# EAGLE schematic arduino_uno_to_attiny_x4 (EAGLE 9.2.2)
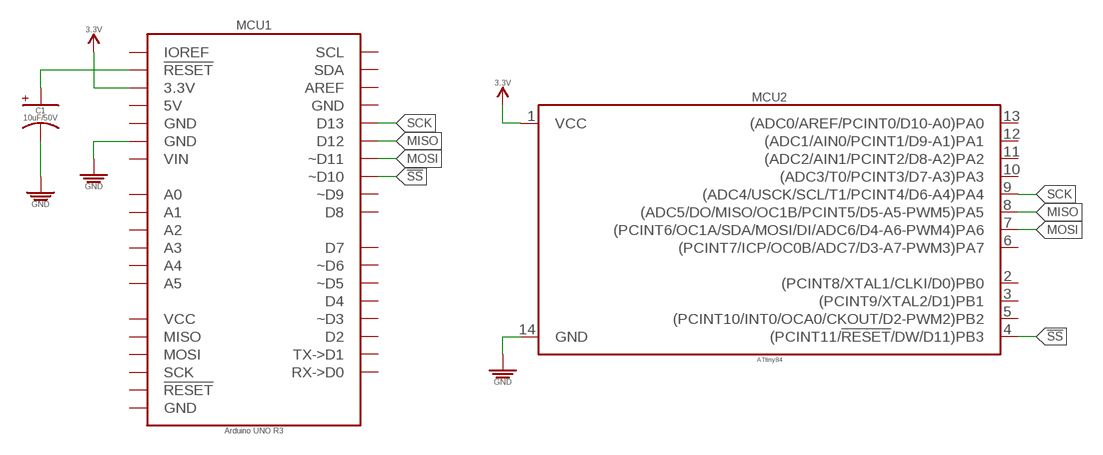
[diagram p0: schematic, sheet 1]

## Parts
C1  10uF/50V  10UF-POLARIZED_PTH_50V-20%  [_AE_PTH-DIA5-LS2-H5]
MCU1  Arduino UNO R3  ARDUINO_UNO_R3  [ARDUINO_UNO_R3]
MCU2  ATtiny84  ATTINY-X4_DIP-14_ATTINY-84  [DIP793W45P254L1919H533Q14B_DIP-14_ATTINY-X4]

## Nets
3.3V: MCU1.3.3V MCU2.1(VCC)
!SS: MCU1.D10(~D10) MCU2.4((PCINT11/!RESET!/DW/D11)PB3)
GND: C1.-(K) MCU1.GND@3(GND) MCU2.14(GND)
MISO: MCU1.D12 MCU2.8((ADC5/DO/MISO/OC1B/PCINT5/D5-A5-PWM5)PA5)
MOSI: MCU1.D11(~D11) MCU2.7((PCINT6/OC1A/SDA/MOSI/DI/ADC6/D4-A6-PWM4)PA6)
N$1: C1.+(A) MCU1.RESET@1(!RESET!)
SCK: MCU1.D13 MCU2.9((ADC4/USCK/SCL/T1/PCINT4/D6-A4)PA4)
Unconnected: MCU1.5V MCU1.A0 MCU1.A1 MCU1.A2 MCU1.A3 MCU1.A4 MCU1.A5 MCU1.AREF MCU1.D0(RX->D0) MCU1.D1(TX->D1) MCU1.D2 MCU1.D3(~D3) MCU1.D4 MCU1.D5(~D5) MCU1.D6(~D6) MCU1.D7 MCU1.D8 MCU1.D9(~D9) MCU1.GND@1(GND) MCU1.GND@2(GND) MCU1.GND@4(GND) MCU1.IOREF MCU1.MISO MCU1.MOSI MCU1.RESET@2(!RESET!) MCU1.SCK MCU1.SCL MCU1.SDA MCU1.VCC MCU1.VIN MCU2.2((PCINT8/XTAL1/CLKI/D0)PB0) MCU2.3((PCINT9/XTAL2/D1)PB1) MCU2.5((PCINT10/INT0/OCA0/CKOUT/D2-PWM2)PB2) MCU2.6((PCINT7/ICP/OC0B/ADC7/D3-A7-PWM3)PA7) MCU2.10((ADC3/T0/PCINT3/D7-A3)PA3) MCU2.11((ADC2/AIN1/PCINT2/D8-A2)PA2) MCU2.12((ADC1/AIN0/PCINT1/D9-A1)PA1) MCU2.13((ADC0/AREF/PCINT0/D10-A0)PA0)

## Library data of the parts
C1 = PiB_capacitors:10UF-POLARIZED; DATASHEET: https://industrial.panasonic.com/cdbs/www-data/pdf/RDF0000/ABA0000C1050.pdf; DIST: Digikey; DISTLINK: https://www.digikey.com/products/en/capacitors/aluminum-electrolytic-capacitors/58?k=P828-ND; DISTPN: P828-ND; MFR: Panasonic Electronic Components; MPN: ECE-A1HKA100
MCU1 = PiB_boards:ARDUINO_UNO_R3; DATASHEET: https://media.digikey.com/pdf/Data%20Sheets/Arduino%20PDFs/A000066_Web.pdf; DATASHEET_CABLE: http://www.assmann-wsw.com/fileadmin/datasheets/ASS_7066_CA.pdf; DIST: Digikey; DISTLINK: https://www.digikey.com/products/en?keywords=1050-1024-ND; DISTLINK_CABLE: https://www.digikey.com/products/en?keywords=AE1462-ND; DISTPN: 1050-1024-ND; DISTPN_CABLE: AE1462-ND; DIST_CABLE: Digikey; MFR: Arduino; MFR_CABLE: Assmann WSW Components; MPN: A000066; MPN_CABLE: AK672/2-1
MCU2 = PiB_ic_microcontrollers:ATTINY-X4; DATASHEET: http://www.microchip.com/mymicrochip/filehandler.aspx?ddocname=en590190; DIST: Digikey; DISTLINK: https://www.digikey.com/products/en?keywords=ATTINY84A-PU-ND; DISTPN: ATTINY84A-PU-ND; MFR: Microchip Technology; MPN: ATTINY84A-PU